# Altium schematic sheet isoJTAG-FTDI.SchDoc
size A4; Organization: UltraZohm
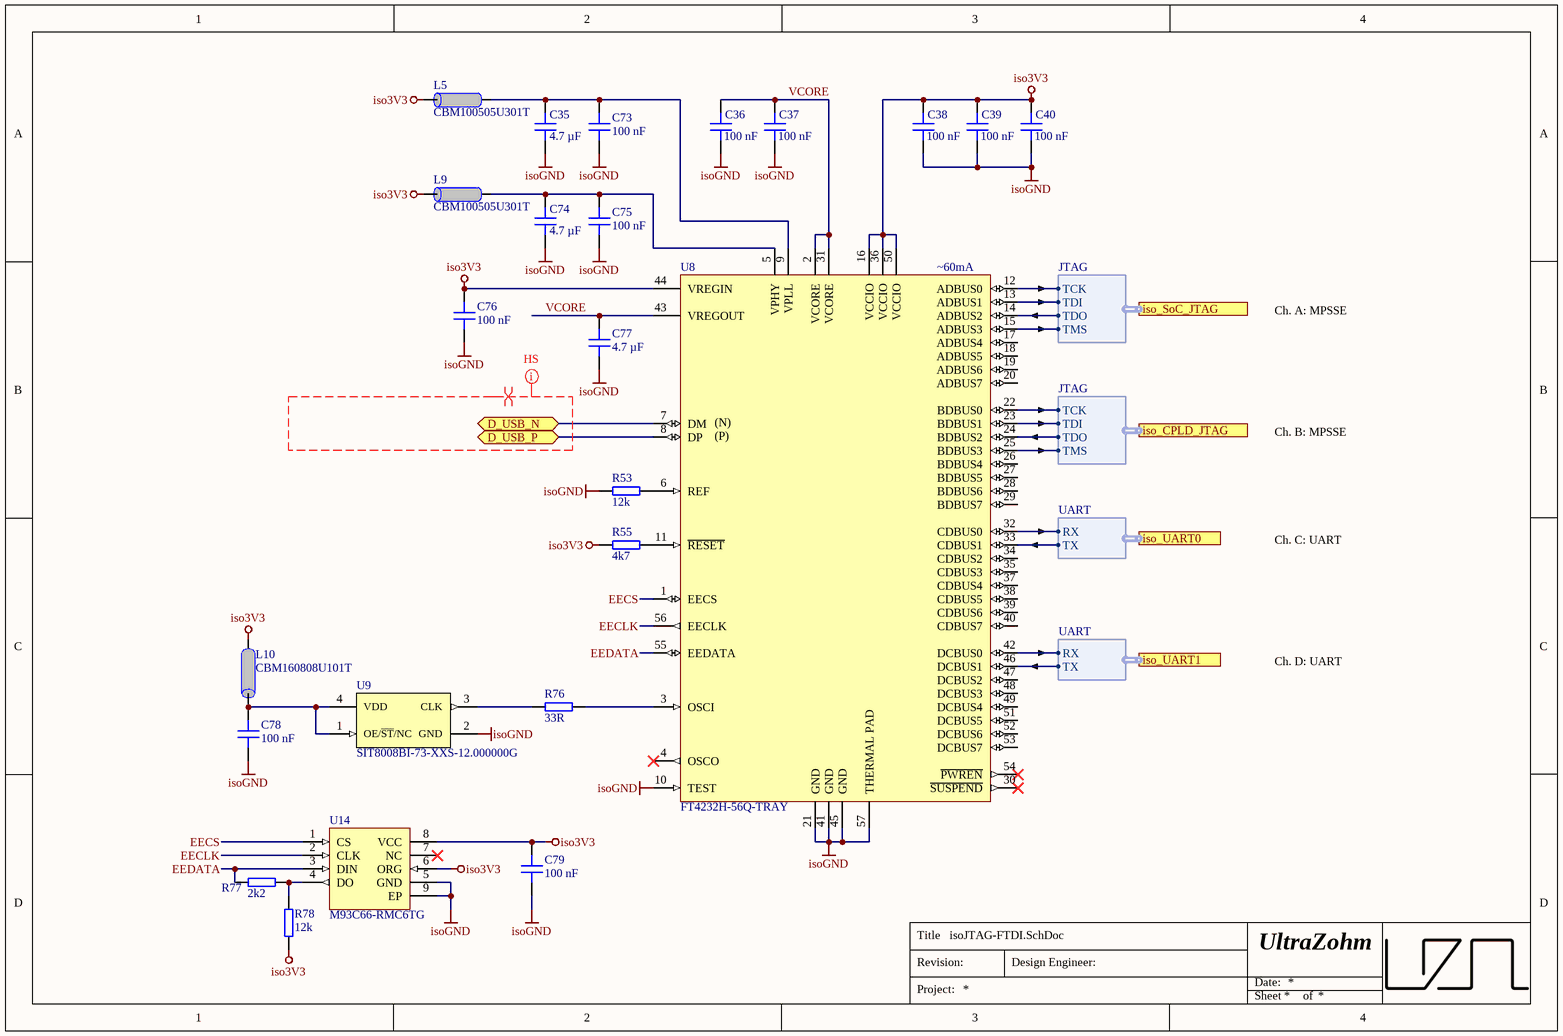
[diagram p0: isoJTAG-FTDI.SchDoc]

## Parts
C35  4.7 µF  [C_0402_TE]
C36  100 nF  [C_0402_TE]
C37  100 nF  [C_0402_TE]
C38  100 nF  [C_0402_TE]
C39  100 nF  [C_0402_TE]
C40  100 nF  [C_0402_TE]
C73  100 nF  [C_0402_TE]
C74  4.7 µF  [C_0402_TE]
C75  100 nF  [C_0402_TE]
C76  100 nF  [C_0402_TE]
C77  4.7 µF  [C_0402_TE]
C78  100 nF  [C_0402_TE]
C79  100 nF  [C_0402_TE]
L5  CBM100505U301T  [IND_0402_TE]
L9  CBM100505U301T  [IND_0402_TE]
L10  CBM160808U101T  [IND_0603_TE]
R53  12k  [R_0402_TE]
R55  4k7  [R_0402_TE]
R76  33R  [R_0402_TE]
R77  2k2  [R_0402_TE]
R78  12k  [R_0402_TE]
U8  FT4232H-56Q-TRAY  [QFN50P800X800-57T610X610N]
U9  SIT8008BI-73-XXS-12.000000G  [2016]
U14  M93C66-RMC6TG  [UFDFPN8]

## Ports
D_USB_N (bidir), D_USB_P (bidir), iso_CPLD_JTAG (harness JTAG), iso_SoC_JTAG (harness JTAG), iso_UART0 (harness UART), iso_UART1 (harness UART)

## Harnesses
JTAG: TCK, TDI, TDO, TMS
UART: RX, TX

## Nets
iso3V3: C38.2 C39.2 C40.2 C76.2 C79.2 L5.2 L9.2 L10.1 R55.1 R78.1 U8.16(VCCIO) U8.36(VCCIO) U8.44(VREGIN) U8.50(VCCIO) U14.6(ORG) U14.8(VCC)
isoGND: C35.1 C36.1 C37.1 C38.1 C39.1 C40.1 C73.1 C74.1 C75.1 C76.1 C77.1 C78.1 C79.1 R53.1 U8.10(TEST) U8.21(GND) U8.41(GND) U8.45(GND) U8.57(THERMAL_PAD) U9.2(GND) U14.5(GND) U14.9(EP)
D_USB_N: U8.7(DM) ; port D_USB_N
D_USB_P: U8.8(DP) ; port D_USB_P
EECLK: U8.56(EECLK) U14.2(CLK)
EECS: U8.1(EECS) U14.1(CS)
EEDATA: R77.1 U8.55(EEDATA) U14.3(DIN)
VCORE: C36.2 C37.2 C77.2 U8.2(VCORE) U8.31(VCORE) U8.43(VREGOUT)
NetC35_2: C35.2 C73.2 L5.1 U8.9(VPLL)
NetC74_2: C74.2 C75.2 L9.1 U8.5(VPHY)
NetC78_2: C78.2 L10.2 U9.1(OE/~{ST}/NC) U9.4(VDD)
NetR53_2: R53.2 U8.6(REF)
NetR55_2: R55.2 U8.11(~{RESET})
NetR76_1: R76.1 U9.3(CLK)
NetR76_2: R76.2 U8.3(OSCI)
NetR77_2: R77.2 R78.2 U14.4(DO)
NetU8_12: U8.12(ADBUS0) ; port iso_SoC_JTAG.TCK
NetU8_13: U8.13(ADBUS1) ; port iso_SoC_JTAG.TDI
NetU8_14: U8.14(ADBUS2) ; port iso_SoC_JTAG.TDO
NetU8_15: U8.15(ADBUS3) ; port iso_SoC_JTAG.TMS
NetU8_22: U8.22(BDBUS0) ; port iso_CPLD_JTAG.TCK
NetU8_23: U8.23(BDBUS1) ; port iso_CPLD_JTAG.TDI
NetU8_24: U8.24(BDBUS2) ; port iso_CPLD_JTAG.TDO
NetU8_25: U8.25(BDBUS3) ; port iso_CPLD_JTAG.TMS
NetU8_32: U8.32(CDBUS0) ; port iso_UART0.RX
NetU8_33: U8.33(CDBUS1) ; port iso_UART0.TX
NetU8_42: U8.42(DCBUS0) ; port iso_UART1.RX
NetU8_46: U8.46(DCBUS1) ; port iso_UART1.TX

Not connected (* = marked no-connect by the designer): U8 4(OSCO)* 17(ADBUS4) 18(ADBUS5) 19(ADBUS6) 20(ADBUS7) 26(BDBUS4) 27(BDBUS5) 28(BDBUS6) 29(BDBUS7) 30(~{SUSPEND})* 34(CDBUS2) 35(CDBUS3) 37(CDBUS4) 38(CDBUS5) 39(CDBUS6) 40(CDBUS7) 47(DCBUS2) 48(DCBUS3) 49(DCBUS4) 51(DCBUS5) 52(DCBUS6) 53(DCBUS7) 54(~{PWREN})*; U14 7(NC)*

## Layout directives
differential pair: (no net found under the mark)
net class HS: (no net found under the mark)

## Notes on the sheet
- (near U8) ~60mA
- Ch. A: MPSSE
- Ch. B: MPSSE
- Ch. C: UART
- Ch. D: UART
- Title
- Revision:
- Design Engineer:
- Date:
- Project:
- Sheet
- of
- (in symbol FT4232H-56Q-TRAY) (N); (P)

## Library data of the parts
C35 C74 C77 = CL05A475MQ5NRNC: 6.3V 4.7uF X5R ±20% 0402 Multilayer Ceramic Capacitors MLCC - SMD/SMT ROHS; Manufacturer: Samsung Electro-Mechanics; Voltage Rating: 6.3 VDC; Created from: AGeiger; Manufacturer Part Number: CL05A475MQ5NRNC; PartID: 143; Created On: 13.12.2023 21:58:39; ComponentLink1Description: Datasheet; ComponentLink1URL: https://datasheet.lcsc.com/lcsc/1810231822_Samsung-Electro-Mechanics-CL05A475MQ5NRNC_C307423.pdf; Component Type: Capacitor 0402; Device Package: 0402; Last Updated: 13.12.2023 21:58:39; Mounting Type: SMD; Operating Temperature: -55 to +85°C; Series: X5R; Supplier 1: LCSC; Supplier Part Number 1: C307423; Type: Capacitor; Tolerance: 20 %; Value: 4.7 µF; Live Cycle Status: 1; LCSC Part Number: C307423
C36-C40 C73 C75 C76 C78 C79 = GRM155R71H104KE14D: 50V 100nF X7R ±10% 0402 Multilayer Ceramic Capacitors MLCC - SMD/SMT ROHS; Manufacturer: Murata Electronics; Voltage Rating: 50 VDC; Created from: AGeiger; Manufacturer Part Number: GRM155R71H104KE14D; PartID: 144; Created On: 13.12.2023 22:03:54; ComponentLink1Description: Datasheet; ComponentLink1URL: https://datasheet.lcsc.com/lcsc/1809272047_Murata-Electronics-GRM155R71H104KE14D_C77020.pdf; Component Type: Capacitor 0402; Device Package: 0402; Last Updated: 13.12.2023 22:03:54; Mounting Type: SMD; Operating Temperature: -55 to +125°C; Series: X7R; Supplier 1: LCSC; Supplier Part Number 1: C77020; Type: Capacitor; Tolerance: 10 %; Value: 100 nF; Live Cycle Status: 1; LCSC Part Number: C77020
L5 L9 = CBM100505U301T: 300mΩ ±25% 300Ω@100MHz 0402 Ferrite Beads ROHS; Manufacturer: FH (Guangdong Fenghua Advanced Tech); DC current: 0.6 A; Value: 300 mOhm; Created from: AGeiger; Manufacturer Part Number: CBM100505U301T; PartID: 20; Created On: 13.12.2023 22:24:41; ComponentLink1Description: Datasheet; ComponentLink1URL: https://datasheet.lcsc.com/lcsc/2304140030_FH--Guangdong-Fenghua-Advanced-Tech-CBM100505U301T_C394406.pdf; Component Type: Ferrite Beads; Device Package: 0402; Last Updated: 13.12.2023 22:24:41; Mounting Type: SMD; Operating Temperature: -40 to +85°C; Supplier 1: LCSC; Supplier Part Number 1: C394406; Type: Ferrite Bead; Live Cycle Status: 1; LCSC Part Number: C394406
L10 = CBM160808U101T: 60mΩ ±25% 100Ω@100MHz 0603 Ferrite Beads ROHS; Manufacturer: FH (Guangdong Fenghua Advanced Tech); DC current: 2.5 A; Value: 60 mOhm; Created from: AGeiger; Manufacturer Part Number: CBM160808U101T; PartID: 21; Created On: 13.12.2023 22:36:14; ComponentLink1Description: Datasheet; ComponentLink1URL: https://datasheet.lcsc.com/lcsc/1912111437_FH--Guangdong-Fenghua-Advanced-Tech-CBM160808U101T_C361675.pdf; Component Type: Ferrite Beads; Device Package: 0603; Last Updated: 13.12.2023 22:36:14; Mounting Type: SMD; Operating Temperature: -40 to +85°C; Supplier 1: LCSC; Supplier Part Number 1: C361675; Type: Ferrite Bead; Live Cycle Status: 1; LCSC Part Number: C361675
R53 R78 = RC0402FR-0712KL: 62.5mW Thick Film Resistors ±100ppm/℃ ±1% 12kΩ 0402 Chip Resistor - Surface Mount ROHS; Manufacturer: YAGEO; Created from: AGeiger; Manufacturer Part Number: RC0402FR-0712KL; PartID: 307; Created On: 13.12.2023 21:39:32; ComponentLink1Description: Datasheet; ComponentLink1URL: https://datasheet.lcsc.com/lcsc/2304140030_YAGEO-RC0402FR-0712KL_C114760.pdf; Component Type: SMD resistor; Device Package: 0402; Last Updated: 13.12.2023 21:39:32; Mounting Type: SMD; Supplier 1: LCSC; Supplier Part Number 1: C114760; Type: Resistor; Tolerance: 1%; Value: 12k; Live Cycle Status: 1; LCSC Part Number: C114760
R55 = RC0402FR-074K7L: 62.5mW Thick Film Resistors ±100ppm/℃ ±1% 4.7kΩ 0402 Chip Resistor - Surface Mount ROHS; Manufacturer: YAGEO; Created from: AGeiger; Manufacturer Part Number: RC0402FR-074K7L; PartID: 306; Created On: 13.12.2023 21:34:05; ComponentLink1Description: Datasheet; ComponentLink1URL: https://datasheet.lcsc.com/lcsc/2304140030_YAGEO-RC0402FR-074K7L_C105871.pdf; Component Type: SMD resistor; Device Package: 0402; Last Updated: 13.12.2023 21:39:32; Mounting Type: SMD; Supplier 1: LCSC; Supplier Part Number 1: C105871; Type: Resistor; Tolerance: 1%; Value: 4k7; Live Cycle Status: 1; LCSC Part Number: C105871
R76 = RC0402FR-0733RL: 62.5mW Thick Film Resistors ±100ppm/℃ ±1% 33Ω 0402 Chip Resistor - Surface Mount ROHS; Manufacturer: YAGEO; Created from: AGeiger; Manufacturer Part Number: RC0402FR-0733RL; PartID: 308; Created On: 13.12.2023 22:29:11; ComponentLink1Description: Datasheet; ComponentLink1URL: https://datasheet.lcsc.com/lcsc/2304140030_YAGEO-RC0402FR-0733RL_C138002.pdf; Component Type: SMD resistor; Device Package: 0402; Last Updated: 13.12.2023 22:29:11; Mounting Type: SMD; Supplier 1: LCSC; Supplier Part Number 1: C138002; Type: Resistor; Tolerance: 1%; Value: 33R; Live Cycle Status: 1; LCSC Part Number: C138002
R77 = RC0402FR-072K2L: 62.5mW Thick Film Resistors ±100ppm/℃ ±1% 2.2kΩ 0402 Chip Resistor - Surface Mount ROHS; Manufacturer: YAGEO; Created from: AGeiger; Manufacturer Part Number: RC0402FR-072K2L; PartID: 309; Created On: 13.12.2023 22:31:34; ComponentLink1Description: Datasheet; ComponentLink1URL: https://datasheet.lcsc.com/lcsc/2304140030_YAGEO-RC0402FR-072K2L_C114762.pdf; Component Type: SMD resistor; Device Package: 0402; Last Updated: 13.12.2023 22:31:34; Mounting Type: SMD; Supplier 1: LCSC; Supplier Part Number 1: C114762; Type: Resistor; Tolerance: 1%; Value: 2k2; Live Cycle Status: 1; LCSC Part Number: C114762
U8 = FT4232H-56Q-TRAY: USB Interface IC Quad 480Mbs 4 UART USB 2.0 12Mbit; Manufacturer: FTDI; Created from: AGeiger; PartID: 1; Created On: 26.11.2023 16:58:07; ComponentLink1Description: Datasheet; ComponentLink1URL: https://www.mouser.de/datasheet/2/163/DS_FT4232H-1621254.pdf; Component Type: USB Controller; Device Package: VQFN-56; Last Updated: 26.11.2023 16:58:07; Manufacturer Part Number: FT4232H-56Q-TRAY; Mounting Type: SMD; Operating Temperature: -40 to 85 °C; Series: FT4232H; Supplier 1: Mouser; Supplier Part Number 1: 895-FT4232H-56Q-TRAY; Value: FT4232H-56Q-TRAY; LCSC Part Number: C1521561
U9 = SIT8008BI-73-XXS-12.000000G: Clock-Standardoszillatoren -40 to 85C, 2016, 50ppm, 2.25V-3.63V, 12MHz, ST, 250 pcs T&R 8 mm; Manufacturer: SiTime; Created from: AGeiger; Manufacturer Part Number: SIT8008BI-73-XXS-12.000000G; PartID: 2; Created On: 11.01.2024 17:02:48; ComponentLink1Description: Datasheet; ComponentLink1URL: https://www.mouser.de/datasheet/2/371/SiT8008B_datasheet-1291019.pdf; Component Type: Oscillator; Device Package: 2016; Last Updated: 11.01.2024 17:02:48; Mounting Type: SMD; Operating Temperature: -40 to +85 °C; Supplier 1: Mouser; Supplier Part Number 1: 788-8008BI73XXS120G; Value: 12 MHz; LCSC Part Number: C1508636
U14 = M93C66-RMC6TG: 4Kbit MICROWIRE EE 1.8 V to 5.5 V; Manufacturer: STMicroelectronics; Created from: AGeiger; Manufacturer Part Number: M93C66-RMC6TG; PartID: 2; Created On: 19.11.2023 15:06:30; ComponentLink1Description: Datasheet; ComponentLink1URL: https://www.mouser.de/datasheet/2/389/m93c46_w-1849748.pdf; Component Type: EEPROM; Device Package: UFDFPN-8; Last Updated: 19.11.2023 21:39:04; Mounting Type: SMD; Operating Temperature: -40 to +85 °C; Series: M93xxx; Supplier 1: Mouser; Supplier Part Number 1: 511-M93C66-RMC6TG; Supplier 2: LCSC; Supplier Part Number 2: C2061956; Type: Memory; Value: M93C66-RMC6TG; LCSC Part Number: C2061956